# EAGLE design Mareltek Glove Project_esp32 (EAGLE 9.6.2)
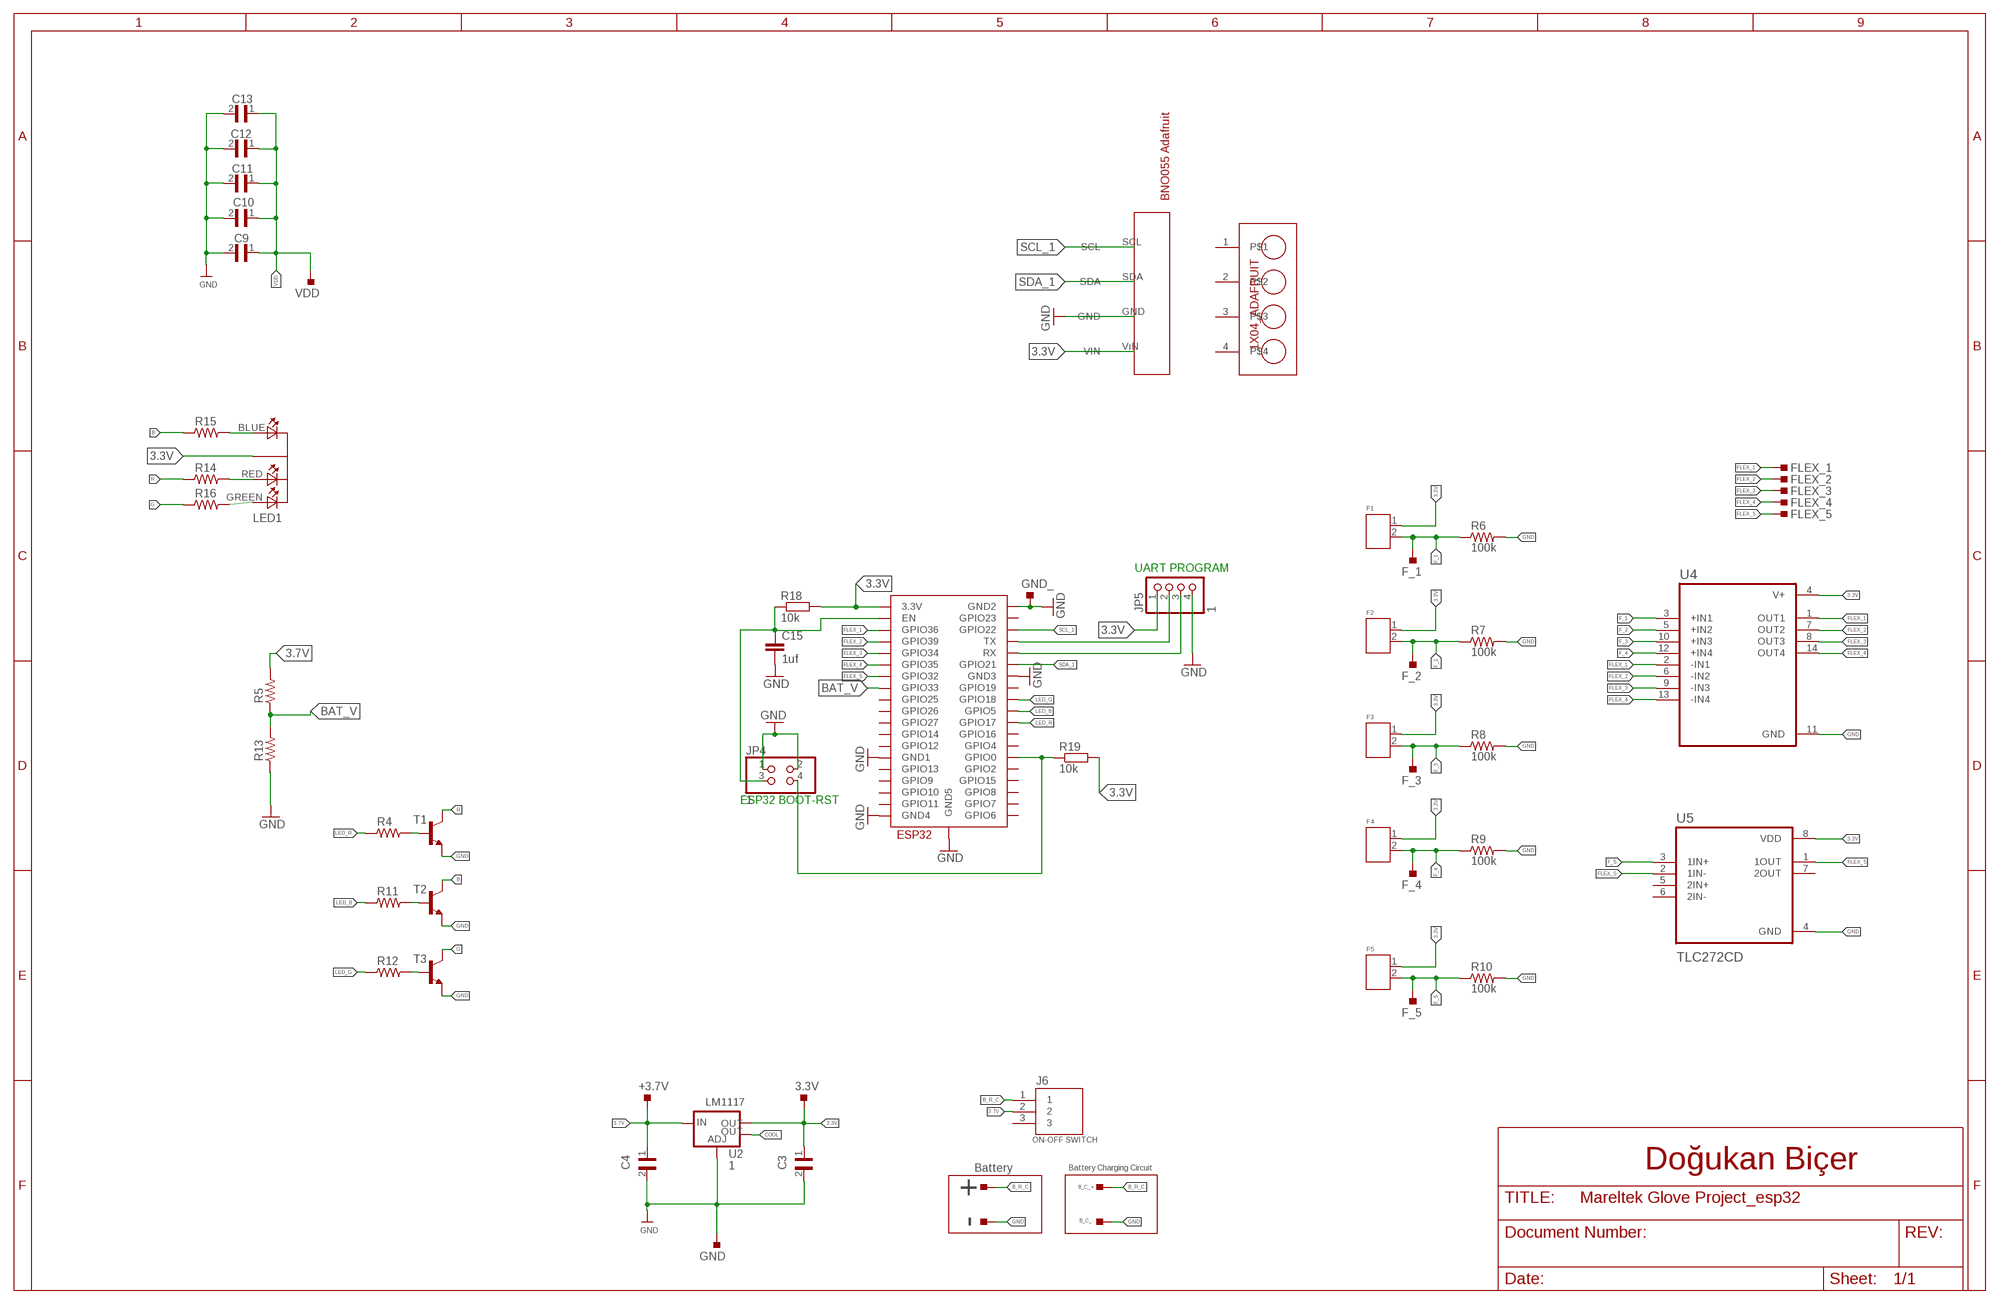
[diagram p0: schematic, sheet 1]

## Parts
3.3V  TESTPOINT_TPS-SMD-10SN  [TESTPOINT_SMD-10SN]
+  TESTPOINT_TPS-PAD-036  [TESTPOINT_PAD-036]
+3.7V  TESTPOINT_TPS-SMD-10SN  [TESTPOINT_SMD-10SN]
-  TESTPOINT_TPS-PAD-036  [TESTPOINT_PAD-036]
B_C_+  TESTPOINT_TPS-PAD-036  [TESTPOINT_PAD-036]
B_C_-  TESTPOINT_TPS-PAD-036  [TESTPOINT_PAD-036]
C3  10uF  CAP_0603  [CAPC1608X90]
C4  10uF  CAP_0603  [CAPC1608X90]
C9  100nF  CAP_0603  [CAPC1608X90]
C10  100nF  CAP_0603  [CAPC1608X90]
C11  100nF  CAP_0603  [CAPC1608X90]
C12  100nF  CAP_0603  [CAPC1608X90]
C13  100nF  CAP_0603  [CAPC1608X90]
C15  1uf  C-EUC0805  [C0805]
F1  FLEX_CONNECTOR  [FLEX_CONNECTOR]
F2  FLEX_CONNECTOR  [FLEX_CONNECTOR]
F3  FLEX_CONNECTOR  [FLEX_CONNECTOR]
F4  FLEX_CONNECTOR  [FLEX_CONNECTOR]
F5  FLEX_CONNECTOR  [FLEX_CONNECTOR]
F_1  TESTPOINT_TPS-SMD-10SN  [TESTPOINT_SMD-10SN]
F_2  TESTPOINT_TPS-SMD-10SN  [TESTPOINT_SMD-10SN]
F_3  TESTPOINT_TPS-SMD-10SN  [TESTPOINT_SMD-10SN]
F_4  TESTPOINT_TPS-SMD-10SN  [TESTPOINT_SMD-10SN]
F_5  TESTPOINT_TPS-SMD-10SN  [TESTPOINT_SMD-10SN]
FLEX_1  TESTPOINT_TPS-SMD-10SN  [TESTPOINT_SMD-10SN]
FLEX_2  TESTPOINT_TPS-SMD-10SN  [TESTPOINT_SMD-10SN]
FLEX_3  TESTPOINT_TPS-SMD-10SN  [TESTPOINT_SMD-10SN]
FLEX_4  TESTPOINT_TPS-SMD-10SN  [TESTPOINT_SMD-10SN]
FLEX_5  TESTPOINT_TPS-SMD-10SN  [TESTPOINT_SMD-10SN]
GND  TESTPOINT_TPS-SMD-10SN  [TESTPOINT_SMD-10SN]
GND_  TESTPOINT_TPS-SMD-10SN  [TESTPOINT_SMD-10SN]
J6  ON-OFF SWITCH  BUTTONS  [TE_5-146293-3]
JP4  1  PINHD-2X2  [2X02]
JP5  1  PINHD-1X4  [1X04]
LED1  LED-DIP-3  [DIP-4]
R4  100R  RC-MASTER-SMD_RESISTOR0603MP  [RC-MASTER-SMD_R0603MP]
R5  100k  RC-MASTER-SMD_RESISTOR0603MP  [RC-MASTER-SMD_R0603MP]
R6  100k  RC-MASTER-SMD_RESISTOR0603MP  [RC-MASTER-SMD_R0603MP]
R7  100k  RC-MASTER-SMD_RESISTOR0603MP  [RC-MASTER-SMD_R0603MP]
R8  100k  RC-MASTER-SMD_RESISTOR0603MP  [RC-MASTER-SMD_R0603MP]
R9  100k  RC-MASTER-SMD_RESISTOR0603MP  [RC-MASTER-SMD_R0603MP]
R10  100k  RC-MASTER-SMD_RESISTOR0603MP  [RC-MASTER-SMD_R0603MP]
R11  100R  RC-MASTER-SMD_RESISTOR0603MP  [RC-MASTER-SMD_R0603MP]
R12  100R  RC-MASTER-SMD_RESISTOR0603MP  [RC-MASTER-SMD_R0603MP]
R13  330R  RC-MASTER-SMD_RESISTOR0603MP  [RC-MASTER-SMD_R0603MP]
R14  100R  RC-MASTER-SMD_RESISTOR0603MP  [RC-MASTER-SMD_R0603MP]
R15  100R  RC-MASTER-SMD_RESISTOR0603MP  [RC-MASTER-SMD_R0603MP]
R16  100R  RC-MASTER-SMD_RESISTOR0603MP  [RC-MASTER-SMD_R0603MP]
R18  10k  R-EU_R0603  [R0603]
R19  10k  R-EU_R0603  [R0603]
T1  TRANSISTORBC846BLT1SOT23-BEC  [SOT23-BEC]
T2  TRANSISTORBC846BLT1SOT23-BEC  [SOT23-BEC]
T3  TRANSISTORBC846BLT1SOT23-BEC  [SOT23-BEC]
U2  1  LM1117_V_REGULATORSOT223  [SOT223]
U4  LM324  LM324M  [SOIC127P600X175-14N]
U5  TLC272CD  [SOIC127P599X175-8N]
U$2  BNO055_ADAFRUIT  [1X06_ROUND_76]
U$4  1X04_ADAFRUIT  [1X04_ROUND_76]
U$7  ESP32-WROOM  [ESP32-WROOM]
VDD  TESTPOINT_TPS-SMD-10SN  [TESTPOINT_SMD-10SN]

## Nets
3.3V [power]: 3.3V.TP C3.1 F1.1 F2.1 F3.1 F4.1 F5.1 JP5.1 LED1.COMMON_CATHODE(COM-CATHODE) R18.2 R19.2 U2.2(OUT) U4.4(V+) U5.8(VDD) U$2.VıN(VIN) U$7.3V3(3.3V)
3.7V [power]: +3.7V.TP C4.1 J6.2 R5.2 U2.3(IN)
B: R15.1 T2.C
B_R_C: +.1(TP) B_C_+.1(TP) J6.1
BAT_V: R5.1 R13.2 U$7.IO33(GPIO33)
COOL: U2.4(OUT)
ESP32_RESET: C15.1 JP4.3 R18.1 U$7.EN
F_1: F1.2 F_1.TP R6.1 U4.3(+IN1)
F_2: F2.2 F_2.TP R7.1 U4.5(+IN2)
F_3: F3.2 F_3.TP R8.1 U4.10(+IN3)
F_4: F4.2 F_4.TP R9.1 U4.12(+IN4)
F_5: F5.2 F_5.TP R10.1 U5.3(1IN+)
FLEX_1: FLEX_1.TP U4.1(OUT1) U4.2(-IN1) U$7.SENSOR_VP(GPIO36)
FLEX_2: FLEX_2.TP U4.6(-IN2) U4.7(OUT2) U$7.SENSOR_VN(GPIO39)
FLEX_3: FLEX_3.TP U4.8(OUT3) U4.9(-IN3) U$7.IO34(GPIO34)
FLEX_4: FLEX_4.TP U4.13(-IN4) U4.14(OUT4) U$7.IO35(GPIO35)
FLEX_5: FLEX_5.TP U5.1(1OUT) U5.2(1IN-) U$7.IO32(GPIO32)
G: R16.1 T3.C
GND [power]: -.1(TP) B_C_-.1(TP) C3.2 C4.2 C9.2 C10.2 C11.2 C12.2 C13.2 C15.2 GND.TP GND_.TP JP4.1 JP4.2 JP5.4 R6.2 R7.2 R8.2 R9.2 R10.2 R13.1 T1.E T2.E T3.E U2.1(ADJ) U4.11(GND) U5.4(GND) U$2.GND U$7.GND1 U$7.GND2 U$7.GND3 U$7.GND4 U$7.GND5
LED_B: R11.1 U$7.IO5(GPIO5)
LED_G: R12.1 U$7.IO18(GPIO18)
LED_R: R4.1 U$7.IO17(GPIO17)
N$2: R4.2 T1.B
N$3: R11.2 T2.B
N$4: LED1.RED R14.2
N$5: LED1.BLUE R15.2
N$6: LED1.GREEN R16.2
N$7: R12.2 T3.B
N$16: JP5.2 U$7.TX
N$17: JP5.3 U$7.RX
N$18: JP4.4 R19.1 U$7.IO0(GPIO0)
R: R14.1 T1.C
SCL_1: U$2.SCL U$7.IO22(GPIO22)
SDA_1: U$2.SDA U$7.IO21(GPIO21)
VDD [power]: C9.1 C10.1 C11.1 C12.1 C13.1 VDD.TP
Unconnected: J6.3 U5.5(2IN+) U5.6(2IN-) U5.7(2OUT) U$4.1 U$4.2 U$4.3 U$4.4 U$7.CLK(GPIO6) U$7.CMD(GPIO11) U$7.IO2(GPIO2) U$7.IO4(GPIO4) U$7.IO12(GPIO12) U$7.IO13(GPIO13) U$7.IO14(GPIO14) U$7.IO15(GPIO15) U$7.IO16(GPIO16) U$7.IO19(GPIO19) U$7.IO23(GPIO23) U$7.IO25(GPIO25) U$7.IO26(GPIO26) U$7.IO27(GPIO27) U$7.SD0(GPIO7) U$7.SD1(GPIO8) U$7.SD2(GPIO9) U$7.SD3(GPIO10)

## Notes on the sheet
- UART PROGRAM
- ESP32 BOOT-RST
- LM1117
- Battery | Battery Charging Circuit | Doğukan Biçer

## Library data of the parts
3.3V +3.7V F_1-F_5 FLEX_1-FLEX_5 GND GND_ VDD = Mareltek Detector Hand Library:TESTPOINT_TPS: TEST POINT PAD; BOM: EXCLUDE
+ - B_C_+ B_C_- = 52101-101-REV-A_v16:TESTPOINT_TPS: TEST POINT PAD; BOM: EXCLUDE
C3 C4 C9-C13 = Mareltek Detector Hand Library:CAP_0603: Cap Ceramic 390pF 25V X7R 10% SMD 0603 125°C Paper T/R Check prices <https://pricing.snapeda.com/parts/06033C391KAT4A/AVX/view-part?ref=eda>; AVAILABILITY: Warning; DESCRIPTION: 0603 390 pF 25 V ±10% Tolerance X7R SMT Multilayer Ceramic Capacitor; MF: AVX; MP: 06033C391KAT4A; PACKAGE: 0603 AVX; PRICE: None; PURCHASE-URL: https://pricing.snapeda.com/search/part/06033C391KAT4A/?ref=eda; SPICEPREFIX: C
C15 = rcl:C-EU: CAPACITOR, European symbol; SPICEPREFIX: C
F1-F5 = Mareltek Detector Hand Library:FLEX_CONNECTOR: 2 Pin Male Connector for Flex Sensor (2.54mm)
J6 = Mareltek Detector Hand Library:BUTTONS: Check prices <https://pricing.snapeda.com/parts/5-146293-3/TE%20Connectivity/view-part?ref=eda>; AVAILABILITY: Good; COMMENT: 5-146293-3; DESCRIPTION: Connector Header Through Hole 3 position 0.100 (2.54mm); EU_ROHS_COMPLIANCE: Compliant; MF: TE Connectivity; MP: 5-146293-3; PACKAGE: None; PRICE: None; PURCHASE-URL: https://pricing.snapeda.com/search/part/5-146293-3/?ref=eda; SPICEPREFIX: J
JP4 = pinhead:PINHD-2X2: PIN HEADER
JP5 = pinhead:PINHD-1X4: PIN HEADER
LED1 = _led-rgb:LED-DIP-3: RGB DIP LED Edited: brunql DIP 4 Pin Special for AmbilightUSB
R4 R5 R11-R16 = Mareltek Detector Hand Library:RC-MASTER-SMD_RESISTOR: RESISTOR; SPICEPREFIX: R
R6-R10 = Mareltek Detector Hand Library:RC-MASTER-SMD_RESISTOR: RESISTOR; SPICEPREFIX: W
R18 R19 = rcl:R-EU_: RESISTOR, European symbol; SPICEPREFIX: R
T1-T3 = Mareltek Detector Hand Library:TRANSISTOR: NPN Transistror BF959 corrected 2008.03.06
U2 = Mareltek Detector Hand Library:LM1117_V_REGULATOR: Voltage Regulator LM1117 Standard adjustable voltage regulator but in SMD form. Spark Fun Electronics SKU : COM-00595; PROD_ID: VREG-08170
U4 = Mareltek Detector Hand Library:LM324M: Check prices <https://pricing.snapeda.com/parts/LM324M/Texas%20Instruments/view-part?ref=eda>; AVAILABILITY: Good; DESCRIPTION: Low power general-purpose quad operational amplifier 14-SOIC 0 to 70; MF: Texas Instruments; MP: LM324M; PACKAGE: SOIC-14 Texas Instruments; PRICE: None; PURCHASE-URL: https://pricing.snapeda.com/search/part/LM324M/?ref=eda; SPICEPREFIX: X
U5 = Mareltek Detector Hand Library:TLC272CD: Check prices <https://pricing.snapeda.com/parts/TLC272CD/Texas%20Instruments/view-part?ref=eda>; AVAILABILITY: Good; DESCRIPTION: Dual Single Supply Operational Amplifier 8-SOIC 0 to 70; MF: Texas Instruments; MP: TLC272CD; PACKAGE: SOIC-8 Texas Instruments; PRICE: None; PURCHASE-URL: https://pricing.snapeda.com/search/part/TLC272CD/?ref=eda
U$2 = microbuilder:BNO055_ADAFRUIT
U$4 = microbuilder:1X04_ADAFRUIT
U$7 = ESP32:ESP32-WROOM

## Net classes
0 default: width 0.203 mm, drill 0.152 mm, clearance 0.152 mm
1 power: width 0.381 mm, drill 0.152 mm, clearance 0.152 mm

## Board
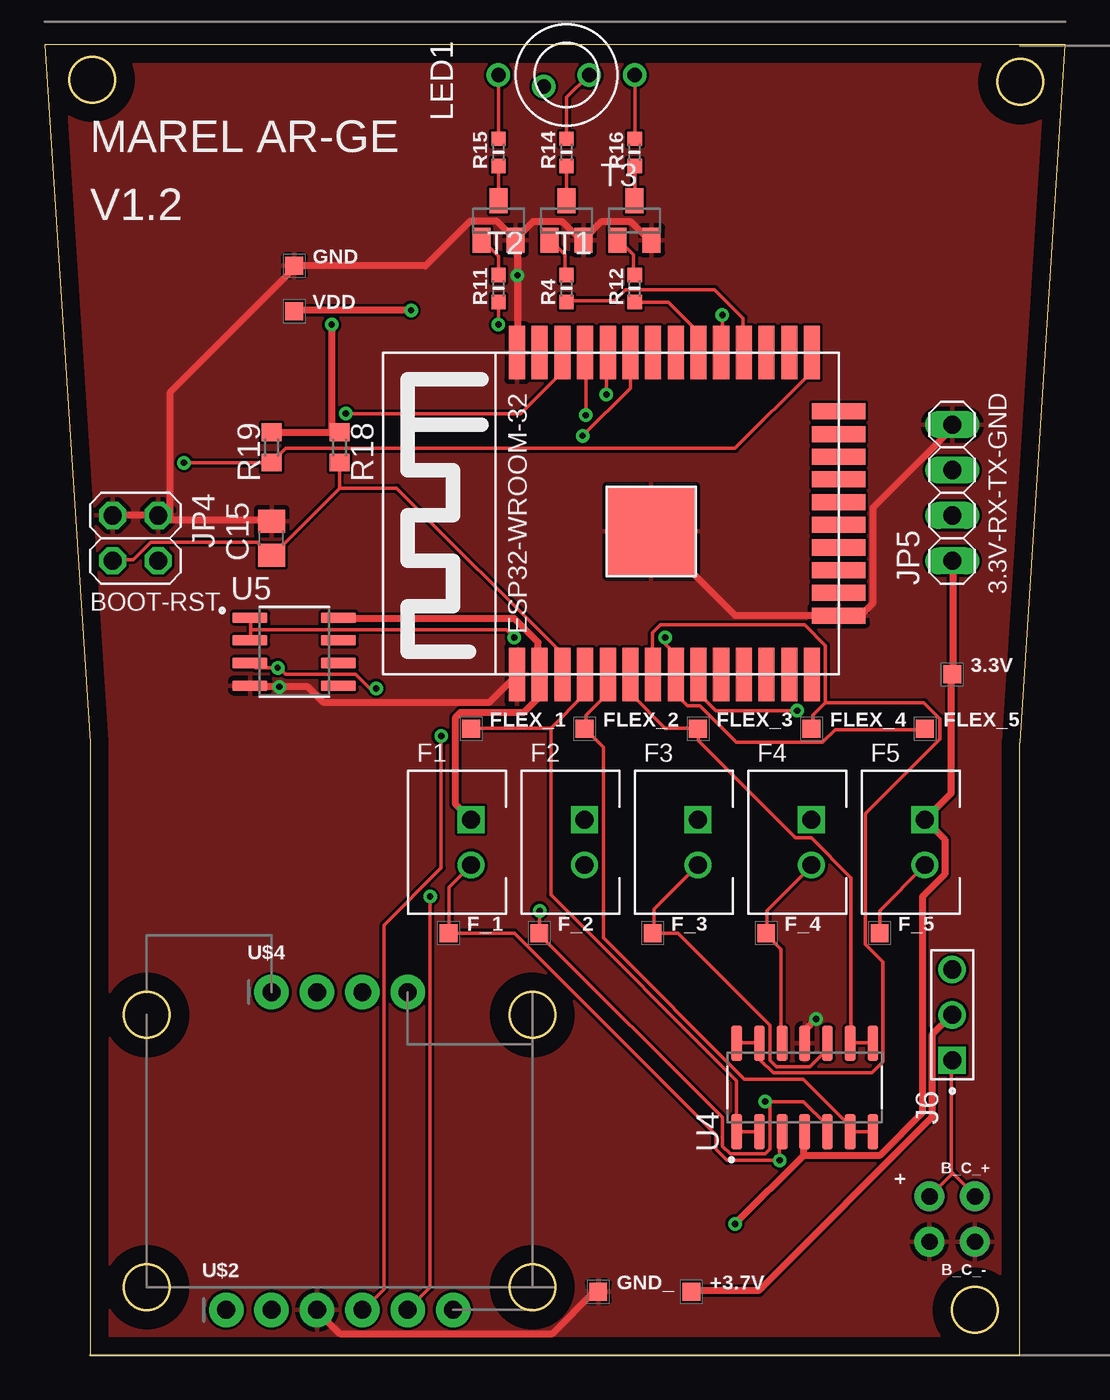
[diagram p1: board, top side]
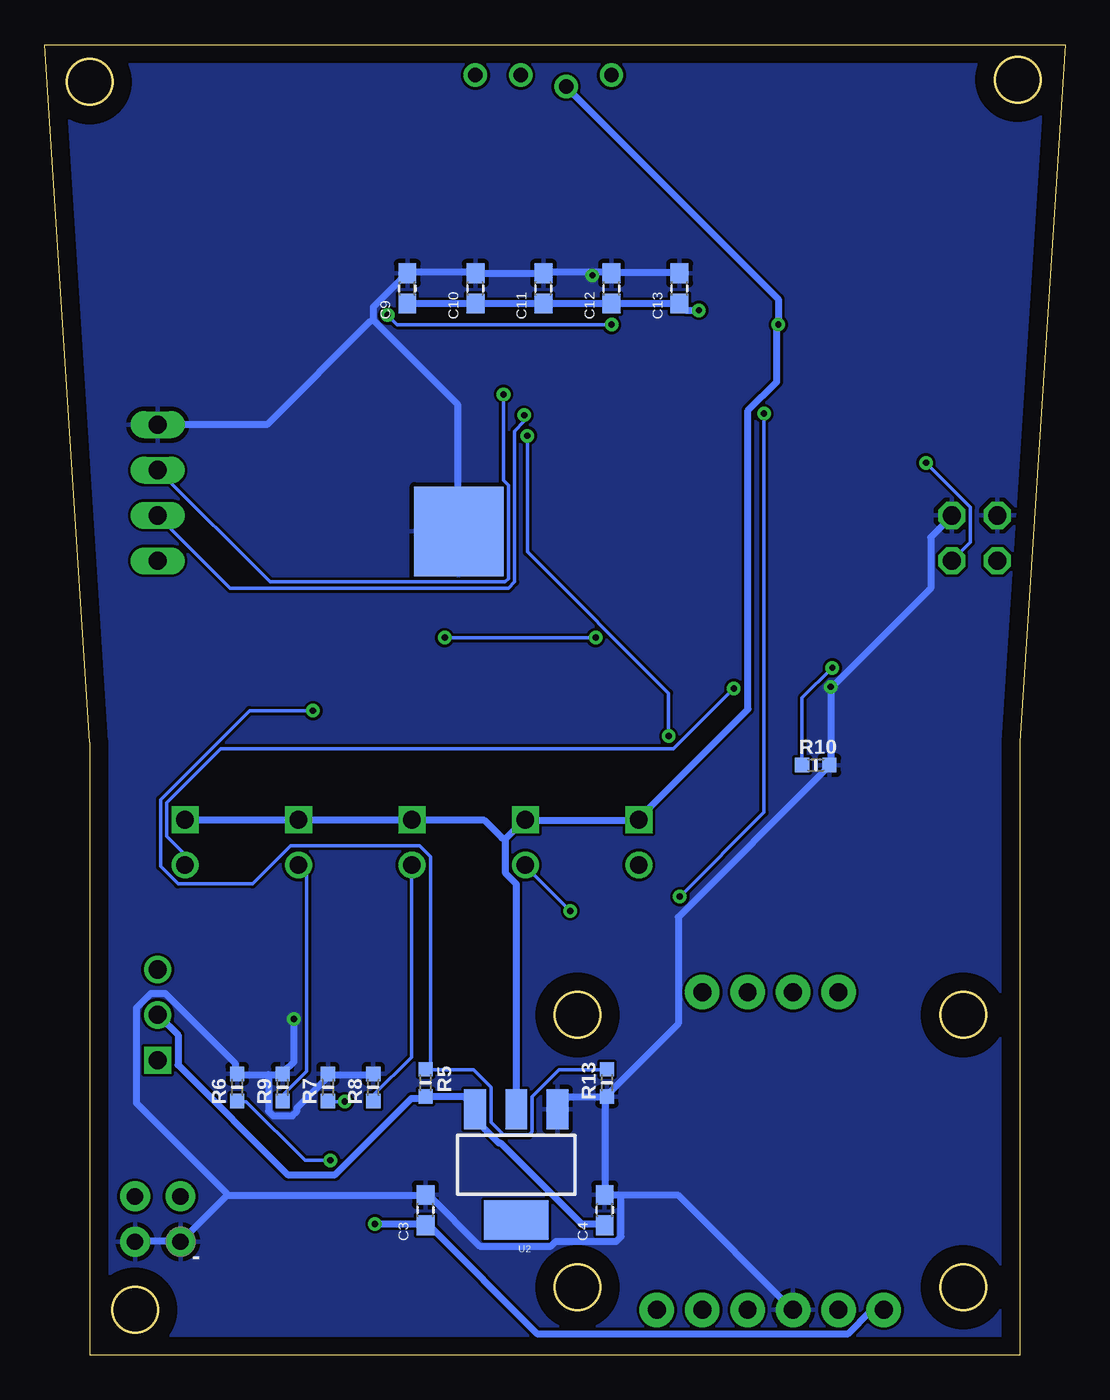
[diagram p2: board, bottom side, seen from below]

Size 57.13 x 73.33 mm. Coordinates in mm from the lower left corner, seen from the top.
Outline: 2.54,0 54.59,0 54.59,34.27 54.61,34.29 57.13,73.33 0,73.33 2.54,34.29 2.54,0
Outline: circle at 2.67,71.37 radius 1.27
Outline: circle at 54.61,71.25 radius 1.27
Outline: circle at 52.07,2.54 radius 1.27
Outline: circle at 27.3,3.81 radius 1.27
Outline: circle at 5.71,3.81 radius 1.27
Outline: circle at 5.71,19.05 radius 1.27
Outline: circle at 27.3,19.05 radius 1.27
Copper layers (1*16): Top 0.035mm / dielectric 1.5mm / Bottom 0.035mm
Design rules "default": minimum track width 6mil, minimum drill 0.35mm, track to track 6mil, track to pad 6mil, pad to pad 6mil, via to via 6mil, smd to smd 6mil, copper to edge 40mil, drill to drill 6mil, minimum pad ring 10mil, minimum via ring 8mil, stop-mask expansion 4mil, vias tented up to drill 0mil, thermal gap 10mil

### Footprints (pad centres in the part's own frame; a part is rotated, then mirrored left to right if it is on the bottom)
TESTPOINT_SMD-10SN = smd 1 x 1: TP 0,0
TESTPOINT_PAD-036 = drill 0.914 pad 1.676: 1 0,0
CAPC1608X90 = smd 1.1 x 1: 1 -0.85,0; 2 0.85,0
C0805 = smd 1.3 x 1.5: 1 -0.95,0; 2 0.95,0
FLEX_CONNECTOR = drill 1 square: 1 2.54,1.27 | drill 1: 2 2.54,-1.27
TE_5-146293-3 = drill 1.02 pad 1.37 square: 1 0,0 | drill 1.02 pad 1.37: 2 2.54,0; 3 5.08,0
2X02 = drill 1.016 octagon: 1 -1.27,-1.27; 2 -1.27,1.27; 3 1.27,-1.27; 4 1.27,1.27
1X04 = drill 1.016 long: 1 -3.81,0; 2 -1.27,0; 3 1.27,0; 4 3.81,0
DIP-4 = drill 0.8: BLUE 0,5.08; COMMON_CATHODE -0.635,2.54; GREEN 0,-2.54; RED 0,0
RC-MASTER-SMD_R0603MP = smd 0.8 x 0.8: 1 -0.762,0; 2 0.762,0
R0603 = smd 1 x 1.1: 1 -0.85,0; 2 0.85,0
SOT23-BEC = smd 1 x 1.4: B -0.95,-1.1; C 0,1.1; E 0.95,-1.1
SOT223 = smd 1.219 x 2.235: 1 -2.311,-3.099; 2 0,-3.099; 3 2.311,-3.099 | smd 3.6 x 2.2: 4 0,3.099
SOIC127P600X175-14N = smd 1.97 x 0.6: 1 -2.475,3.81; 2 -2.475,2.54; 3 -2.475,1.27; 4 -2.475,0; 5 -2.475,-1.27; 6 -2.475,-2.54; 7 -2.475,-3.81; 8 2.475,-3.81; 9 2.475,-2.54; 10 2.475,-1.27; 11 2.475,0; 12 2.475,1.27; 13 2.475,2.54; 14 2.475,3.81
SOIC127P599X175-8N = smd 1.97 x 0.6: 1 -2.47,1.905; 2 -2.47,0.635; 3 -2.47,-0.635; 4 -2.47,-1.905; 5 2.47,-1.905; 6 2.47,-0.635; 7 2.47,0.635; 8 2.47,1.905
1X06_ROUND_76 = drill 1 pad 1.93: 2 -3.81,0; 6 6.35,0; GND -1.27,0; SCL 3.81,0; SDA 1.27,0; VıN -6.35,0
1X04_ROUND_76 = drill 1 pad 1.93: 1 -3.81,0; 2 -1.27,0; 3 1.27,0; 4 3.81,0
ESP32-WROOM = smd 3 x 0.9: 3V3 0,16.74; EN 0,15.47; GND1 0,18.01; GND3 18,18.01; IO0 18,1.5; IO4 18,2.77; IO5 18,6.58; IO12 0,1.5; IO14 0,2.77; IO16 18,4.04; IO17 18,5.31; IO18 18,7.85; IO19 18,9.12; IO21 18,11.66; IO22 18,15.47; IO23 18,16.74; IO25 0,6.58; IO26 0,5.31; IO27 0,4.04; IO32 0,9.12; IO33 0,7.85; IO34 0,11.66; IO35 0,10.39; NC 18,10.39; RX 18,12.93; SENSOR_VN 0,12.93; SENSOR_VP 0,14.2; TX 18,14.2 | smd 0.9 x 3: CLK 9.635,0; CMD 8.365,0; GND2 3.285,0; IO2 14.715,0; IO13 4.555,0; IO15 13.445,0; SD0 10.905,0; SD1 12.175,0; SD2 5.825,0; SD3 7.095,0 | smd 5 x 5: GND4 8,10.5 | smd 5 x 5 bottom: GND5 8,10.5

### Placement (x,y rotation side)
3.3V  50.8,38.1 0 top
+  49.53,8.89 0 top
+3.7V  36.2,3.56 0 top
-  49.53,6.35 0 bottom
B_C_+  52.07,8.89 90 top
B_C_-  52.07,6.35 270 top
C3  35.81,8.13 90 bottom
C4  25.78,8.13 90 bottom
C9  36.83,59.69 90 bottom
C10  33.02,59.69 90 bottom
C11  29.21,59.69 90 bottom
C12  25.4,59.69 90 bottom
C13  21.59,59.69 90 bottom
C15  12.7,45.72 90 top
F1  21.34,28.7 0 top
F2  27.69,28.7 0 top
F3  34.04,28.7 0 top
F4  40.39,28.7 0 top
F5  46.74,28.7 0 top
F_1  22.61,23.62 0 top
F_2  27.69,23.62 0 top
F_3  34.04,23.62 0 top
F_4  40.39,23.62 0 top
F_5  46.74,23.62 0 top
FLEX_1  23.88,35.05 0 top
FLEX_2  30.23,35.05 0 top
FLEX_3  36.58,35.05 0 top
FLEX_4  42.93,35.05 0 top
FLEX_5  49.28,35.05 0 top
GND  13.97,60.96 0 top
GND_  30.99,3.56 0 top
J6  50.8,16.51 90 top
JP4  5.08,45.72 270 top
JP5  50.8,48.26 90 top
LED1  30.48,71.63 90 top
R4  29.21,59.69 90 top
R5  35.81,15.24 270 bottom
R6  46.35,14.99 90 bottom
R7  41.27,14.99 90 bottom
R8  38.73,14.99 90 bottom
R9  43.81,14.99 90 bottom
R10  13.97,33.02 0 bottom
R11  25.4,59.69 90 top
R12  33.02,59.69 90 top
R13  25.65,15.24 90 bottom
R14  29.21,67.31 90 top
R15  25.4,67.31 90 top
R16  33.02,67.31 90 top
R18  16.51,50.8 90 top
R19  12.7,50.8 90 top
T1  29.21,63.5 0 top
T2  25.4,63.5 0 top
T3  33.02,63.5 0 top
U2  30.73,10.67 180 bottom
U4  42.54,14.99 90 top
U5  13.97,39.37 0 top
U$2  16.51,2.54 0 top
U$4  16.51,20.32 0 top
U$7  44.45,38.1 90 top
VDD  13.97,58.42 0 top

### Tracks (layer width: path | path; a pad name or v marks a point on that pad's centre or on a via)
3.3V  (via drill 0.35)
  Top 0.381: 42.47,11.18 v38.65,7.35 | 42.47,11.18 42.47,12.51 U4.4 | R19.2 12.78,51.62 16.51,51.62 R18.2 16.07,51.8 v16.07,57.67 | U5.8 16.51,41.22 26.29,41.22 27.62,39.89 27.62,38.11 U$7.3V3 27.53,37.93 27.53,36.69 26.82,35.98 23.27,35.98 23,35.71 23,30.82 23.8,30.02 F1.1 | JP5.1 50.82,44.42 50.82,38.11 3.3V.TP 50.74,37.93 50.74,31.45 49.31,30.02 F5.1 50.38,28.87 50.38,26.91 49.14,25.67 49.14,13.58 46.74,11.18 42.47,11.18
  Bottom 0.381: v38.65,7.35 35.89,7.35 C3.1 35.62,7.26 29.58,1.22 12.15,1.22 10.91,2.46 10.2,2.46 U$2.VıN | LED1.COMMON_CATHODE 27.89,70.92 16.07,59.09 v16.07,57.67 16.15,57.49 16.15,54.47 17.75,52.87 17.75,36.16 23.8,30.11 F1.1 23.89,29.93 30.11,29.93 F2.1 30.29,29.93 31.36,28.87 | U2.2 30.73,26.38 31.36,27 31.36,28.87 | 31.36,28.87 31.53,28.96 32.51,29.93 36.51,29.93 F3.1 36.69,29.93 42.91,29.93 F4.1 43.09,29.93 49.22,29.93 F5.1
3.7V
  Top 0.381: +3.7V.TP 36.25,3.62 39.98,3.62 49.67,13.31 49.67,17.93 50.74,19 J6.2
  Bottom 0.381: C4.1 25.84,7.35 27.09,7.35 31.62,11.89 31.71,11.89 32.96,13.13 32.96,13.67 U2.3 33.05,13.84 33.67,14.46 35.8,14.46 R5.2 35.98,14.38 36.6,14.38 40.87,10.11 43.54,10.11 49.67,16.24 49.67,17.93 50.74,19 J6.2
B
  Top 0.203: T2.C R15.1
B_R_C
  Top 0.203: 50.74,10.2 50.74,10.11 49.58,8.95 +.1 | 50.74,10.2 50.74,16.51 J6.1 | B_C_+.1 52.07,8.95 50.82,10.2 50.74,10.2
BAT_V  (via drill 0.35)
  Top 0.203: v42.11,36.07 37.58,36.07 36.6,37.05 36.6,38.02 U$7.IO33
  Bottom 0.203: R13.2 25.67,15.98 28.33,15.98 29.85,14.46 29.85,12.51 30.02,12.33 31.45,12.33 32.16,13.04 32.16,15 33.13,15.98 35.8,15.98 R5.1 35.53,16.07 35.53,27.89 36.16,28.51 43.36,28.51 45.49,26.38 49.67,26.38 50.65,27.36 50.65,31.09 45.67,36.07 v42.11,36.07
ESP32_RESET
  Top 0.203: 16.51,48.51 R18.1 | 16.51,48.51 12.78,44.78 C15.1 12.6,44.78 11.89,45.49 5.93,45.49 4.95,44.51 3.89,44.51 JP4.3 | 16.51,48.51 19.71,48.51 28.96,39.27 28.96,38.11 U$7.EN
F_1  (via drill 0.35)
  Top 0.203: F1.2 22.64,26.2 22.64,23.62 F_1.TP 26.29,23.62 37.58,12.33 37.58,11.53 38.2,10.91 v41.13,10.91 41.13,12.42 41.22,12.51 U4.3
  Bottom 0.203: v41.13,10.91 42.56,10.91 45.85,14.2 46.29,14.2 R6.1
F_2  (via drill 0.35)
  Top 0.203: U4.5 43.8,12.6 43.8,12.87 42.47,14.2 v40.34,14.2 40.6,14.11 40.6,11.53 40.34,11.27 38.38,11.27 37.94,11.71 37.94,13.31 27.71,23.53 F_2.TP 27.71,23.62 v27.71,24.87
  Bottom 0.203: v40.34,14.2 41.22,14.2 R7.1 | v27.71,24.87 30.2,27.36 F2.2
F_3
  Top 0.203: F3.2 36.51,27.36 34.11,24.96 34.11,23.62 F_3.TP 35.45,23.62 40.6,18.47 40.6,16.51 40.96,16.15 42.82,16.15 43.8,17.13 43.8,17.4 U4.10
  Bottom 0.203: R8.1 38.73,14.55 36.6,16.69 36.6,27.36 F3.2
F_4
  Top 0.203: F4.2 42.91,27.36 40.42,24.87 40.42,23.62 F_4.TP 40.42,23.53 41.22,22.73 41.22,17.49 U4.12
  Bottom 0.203: R9.1 43.8,14.29 43.8,14.55 42.47,15.89 42.47,26.91 42.91,27.36 F4.2
F_5  (via drill 0.35)
  Top 0.203: F_5.TP 46.74,24.87 49.22,27.36 F5.2 | U5.3 11.53,38.73 11.8,38.47 v13.04,38.47 13.13,38.47 13.49,38.11 17.4,38.11 18.2,37.31 v18.55,37.31
  Bottom 0.203: R10.1 14.73,36.78 v13.04,38.47 | v18.55,37.31 21.93,33.93 47.27,33.93 50.29,30.91 50.29,29.05 49.31,28.07 49.31,27.45 F5.2
FLEX_1
  Top 0.203: U4.2 39.98,12.51 U4.1 38.73,15.35 28.33,25.76 28.33,35.09 | 28.33,35.09 23.89,35.09 FLEX_1.TP | 28.33,35.09 30.2,36.96 30.2,38.02 U$7.SENSOR_VP
FLEX_2
  Top 0.203: U4.7 46.29,12.51 45.14,12.51 U4.6 45.05,12.6 45.05,12.87 42.47,15.44 39.18,15.44 31.27,23.36 31.27,34.02 30.29,35 FLEX_2.TP 30.29,35.09 30.29,35.8 31.45,36.96 31.45,38.02 U$7.SENSOR_VN
FLEX_3
  Top 0.203: U4.8 46.29,17.49 45.14,17.49 U4.9 45.14,17.58 45.14,26.73 42.91,28.96 42.02,28.96 36.6,34.38 36.6,35 FLEX_3.TP 36.51,35.09 34.73,35.09 32.87,36.96 32.87,38.02 U$7.IO34
FLEX_4
  Top 0.203: U4.14 38.73,17.49 39.98,17.49 U4.13 40.07,17.4 40.07,16.51 40.78,15.8 46.29,15.8 46.91,16.42 46.91,22.02 45.94,23 45.94,30.29 50.11,34.47 50.11,35.62 49.22,36.51 43.71,36.51 | 43.71,36.51 43,35.8 43,35.09 FLEX_4.TP | 43.71,36.51 43.71,39.71 42.56,40.87 34.47,40.87 34.02,40.42 34.02,38.11 U$7.IO35
FLEX_5  (via drill 0.35)
  Top 0.203: 11.53,40.6 11.53,41.22 U5.1 | 11.53,40.6 11.53,40.07 U5.2 | FLEX_5.TP 49.22,35 44.25,35 43.54,34.29 38.73,34.29 36.69,36.33 35.98,36.33 35.36,36.96 35.36,38.02 U$7.IO32 35.27,38.11 35.27,39.27 34.73,39.8 v34.73,40.16 | 11.53,40.6 25.84,40.6 v26.29,40.16
  Bottom 0.203: v34.73,40.16 v26.29,40.16
G
  Top 0.203: R16.1 33.05,66.47 33.05,64.61 T3.C
GND  (via drill 0.35)
  Top 0.381: GND_.TP 30.91,3.53 30.73,3.53 28.42,1.22 16.51,1.22 15.27,2.46 U$2.GND | v43.18,18.82 42.56,18.2 42.56,17.49 U4.11 | U5.4 11.53,37.4 v13.13,37.4 14.73,37.4 15.62,36.51 24.87,36.51 26.38,38.02 U$7.GND1 | C15.2 12.69,46.74 6.55,46.74 6.38,46.91 JP4.2 | JP4.1 3.89,47 6.2,47 JP4.2 | U$7.GND4 34.02,46.02 38.65,41.4 44.42,41.4 U$7.GND2 44.6,41.49 45.76,41.49 46.38,42.11 46.38,47.45 50.74,51.8 50.74,52.07 JP5.4 | T2.E 26.29,62.47 25.31,63.45 23.8,63.45 21.31,60.96 GND.TP 13.93,60.78 7,53.85 7,46.91 JP4.2 | T2.E 26.47,62.56 27.36,63.45 28.96,63.45 29.93,62.47 30.11,62.47 T1.E 30.29,62.56 31.18,63.45 32.78,63.45 33.76,62.47 33.93,62.47 T3.E | U$7.GND3 26.47,56.16 v26.47,60.43 26.47,62.29 T2.E
  Bottom 0.381: R13.1 25.67,14.46 27.8,14.46 28.42,13.84 U2.1 | R13.1 25.76,14.29 25.76,9.04 C4.2 25.58,8.95 24.87,8.95 | 24.87,8.95 21.67,8.95 15.27,2.55 U$2.GND | R8.2 38.73,15.71 41.22,15.71 R7.2 41.31,15.53 43,13.84 43,13.67 43.27,13.4 44.34,13.4 44.6,13.67 44.6,15.71 | 44.6,15.71 46.29,15.71 R6.2 46.47,15.89 46.47,16.33 50.38,20.24 51.18,20.24 51.98,19.44 51.98,14.11 47,9.13 46.91,8.95 | 44.6,15.71 43.89,15.71 R9.2 43.71,15.89 43.18,16.42 v43.18,18.82 | 46.91,8.95 35.89,8.95 C3.2 35.62,8.95 32.78,6.11 28.78,6.11 28.51,6.38 25.13,6.38 24.87,6.64 24.87,8.95 | 46.91,8.95 49.49,6.38 -.1 49.67,6.38 52.07,6.38 B_C_-.1 | 13.13,37.31 13.13,33.04 R10.2 13.31,32.87 21.67,24.51 21.67,18.55 25.58,14.64 R13.1 | 13.13,37.31 7.53,42.91 7.53,45.76 6.38,46.91 JP4.2 | v13.13,37.4 13.13,37.31 | C13.2 21.67,60.6 25.4,60.6 C12.2 25.58,60.6 26.47,60.6 | 26.47,60.6 29.13,60.6 C11.2 29.4,60.51 32.96,60.51 C10.2 33.13,60.6 36.78,60.6 C9.2 36.96,60.43 38.73,58.65 38.73,57.94 | 38.73,57.94 34.02,53.23 34.02,46.11 U$7.GND4 | v26.47,60.43 26.47,60.6 | JP5.4 44.69,52.07 38.91,57.85 38.73,57.94
  pour Top: -2.92,73.66 -2.92,-2.41 59.69,-2.41 59.82,-2.54 59.82,75.18 59.44,75.56 -1.02,75.56
  pour Bottom: -6.6,75.44 -6.6,-6.6 62.48,-6.6 62.74,-6.86 62.74,76.71 -5.33,76.71
LED_B  (via drill 0.35)
  Top 0.203: v25.4,57.67 R11.1 | v37.94,58.2 37.94,56.16 U$7.IO5
  Bottom 0.203: v25.4,57.67 37.4,57.67 v37.94,58.2
LED_G
  Top 0.203: R12.1 33.05,58.91 34.91,58.91 36.51,57.31 36.51,56.16 U$7.IO18
LED_R
  Top 0.203: R4.1 29.22,59 31.89,59 32.51,59.63 37.49,59.63 39.09,58.03 39.09,56.16 U$7.IO17
N$2
  Top 0.203: R4.2 29.13,60.51 29.13,61.58 28.33,62.38 T1.B
N$3
  Top 0.203: R11.2 25.4,61.49 24.51,62.38 T2.B
N$4
  Top 0.203: R14.2 29.22,68.07 29.22,70.38 30.47,71.63 LED1.RED
N$5
  Top 0.203: LED1.BLUE R15.2
N$6
  Top 0.203: R16.2 33.05,68.07 33.05,71.63 LED1.GREEN
N$7
  Top 0.203: R12.2 32.96,60.51 32.96,61.58 32.16,62.38 T3.B
N$16  (via drill 0.35)
  Top 0.203: v30.29,52.6 30.29,56.07 U$7.TX
  Bottom 0.203: v30.29,52.6 30.29,52.25 30.82,51.71 30.82,43.27 31.18,42.91 46.74,42.91 50.74,46.91 JP5.2
N$17  (via drill 0.35)
  Top 0.203: v31.45,53.76 31.45,56.07 U$7.RX
  Bottom 0.203: v31.45,53.76 31.45,48.96 31.18,48.69 31.18,43.45 31.36,43.27 44.51,43.27 50.74,49.49 JP5.3
N$18  (via drill 0.35)
  Top 0.203: v7.8,49.94 12.69,49.94 R19.1 12.78,50.02 13.49,50.74 38.65,50.74 42.91,55 42.91,56.07 U$7.IO0
  Bottom 0.203: v7.8,49.94 5.31,47.45 5.31,45.49 JP4.4
R
  Top 0.203: R14.1 29.22,66.47 29.22,64.61 T1.C
SCL_1  (via drill 0.35)
  Top 0.203: v16.87,52.69 26.64,52.69 28.96,55 28.96,56.07 U$7.IO22 | v21.58,25.67 21.58,3.8 U$2.SCL
  Bottom 0.203: v16.87,52.69 16.87,30.38 v21.58,25.67
SDA_1  (via drill 0.35)
  Top 0.203: v30.11,51.45 32.78,54.11 32.78,56.07 U$7.IO21 | v22.2,34.65 22.2,27.27 19,24.07 19,3.71 17.84,2.55 U$2.SDA
  Bottom 0.203: v30.11,51.45 30.11,44.96 22.2,37.05 v22.2,34.65
VDD  (via drill 0.35)
  Top 0.381: v20.51,58.47 14.02,58.47 VDD.TP
  Bottom 0.381: v20.51,58.47 21.22,58.47 21.58,58.83 C13.1 21.75,58.83 25.4,58.83 C12.1 25.58,58.83 29.13,58.83 C11.1 29.4,58.83 32.96,58.83 C10.1 33.13,58.83 36.78,58.83 C9.1

### Text on the board
tNames: MAREL AR-GE | V1.2 | 3.3V-RX-TX-GND | BOOT-RST